# Altium schematic sheet Stereo_L&R_TPA3138D2.SchDoc
size A4; SheetNumber: 9; SheetTotal: 10
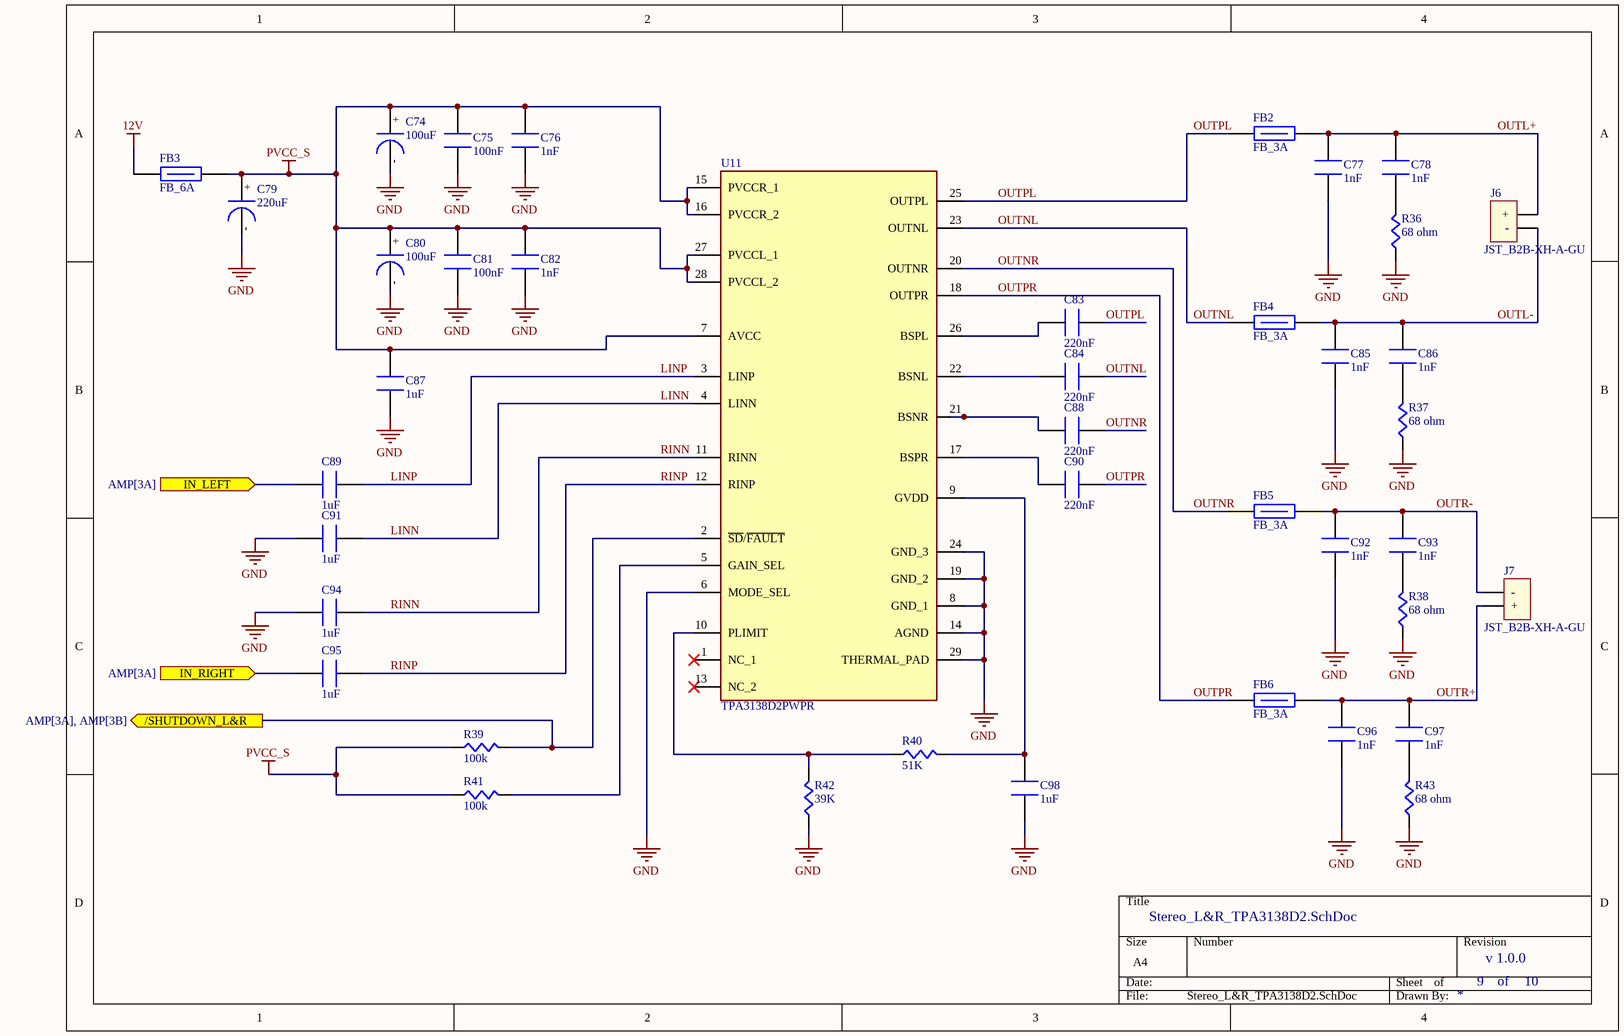
[diagram p0: Stereo_L&R_TPA3138D2.SchDoc]

## Parts
C74  100uF  [CAPD6.3XL6.3X77M]
C75  100nF  [CAPC0603X8N]
C76  1nF  [CAPC0603X8N]
C77  1nF  [CAPC0603X8N]
C78  1nF  [CAPC0603X8N]
C79  220uF  [CAPD6.3XL6.3X77M]
C80  100uF  [CAPD6.3XL6.3X77M]
C81  100nF  [CAPC0603X8N]
C82  1nF  [CAPC0603X8N]
C83  220nF  [CAPC1206X18N]
C84  220nF  [CAPC1206X18N]
C85  1nF  [CAPC0603X8N]
C86  1nF  [CAPC0603X8N]
C87  1uF  [CAP0805X13N]
C88  220nF  [CAPC1206X18N]
C89  1uF  [CAP0805X13N]
C90  220nF  [CAPC1206X18N]
C91  1uF  [CAP0805X13N]
C92  1nF  [CAPC0603X8N]
C93  1nF  [CAPC0603X8N]
C94  1uF  [CAP0805X13N]
C95  1uF  [CAP0805X13N]
C96  1nF  [CAPC0603X8N]
C97  1nF  [CAPC0603X8N]
C98  1uF  [CAP0805X13N]
FB2  FB_3A  [FB0603X08N]
FB3  FB_6A  [FB0805X12N]
FB4  FB_3A  [FB0603X08N]
FB5  FB_3A  [FB0603X08N]
FB6  FB_3A  [FB0603X08N]
J6  JST_B2B-XH-A-GU  [JST_B2B_XH_A_GU]
J7  JST_B2B-XH-A-GU  [JST_B2B_XH_A_GU]
R36  68 ohm  [RECS0603X45N]
R37  68 ohm  [RECS0603X45N]
R38  68 ohm  [RECS0603X45N]
R39  100k  [RECS0603X45N]
R40  51K  [RECS0603X45N]
R41  100k  [RECS0603X45N]
R42  39K  [RECS0603X45N]
R43  68 ohm  [RECS0603X45N]
U11  TPA3138D2PWPR  [SOP65P640X120-29N]

## Ports
/SHUTDOWN_L&R (out, see AMP[3A], AMP[3B]), IN_LEFT (in, see AMP[3A]), IN_RIGHT (in, see AMP[3A])

## Nets
12V: FB3.1
GND: C74.2 C75.1 C76.1 C77.1 C79.2 C80.2 C81.1 C82.1 C85.1 C87.1 C91.1 C92.1 C94.1 C96.1 C98.1 R36.1 R37.1 R38.1 R42.1 R43.1 U11.6(MODE_SEL) U11.8(GND_1) U11.14(AGND) U11.19(GND_2) U11.24(GND_3) U11.29(THERMAL_PAD)
PVCC_S: C74.1 C75.2 C76.2 C79.1 C80.1 C81.2 C82.2 C87.2 FB3.2 R39.1 R41.1 U11.7(AVCC) U11.15(PVCCR_1) U11.16(PVCCR_2) U11.27(PVCCL_1) U11.28(PVCCL_2)
/SHUTDOWN_L&R: R39.2 U11.2(~{SD}/~{FAULT}) ; port /SHUTDOWN_L&R
IN_LEFT: C89.1 ; port IN_LEFT
IN_RIGHT: C95.1 ; port IN_RIGHT
LINN: C91.2 U11.4(LINN)
LINP: C89.2 U11.3(LINP)
OUTL+: C77.2 C78.2 FB2.2 J6.1(+)
OUTL-: C85.2 C86.2 FB4.2 J6.2(-)
OUTNL: C84.2 FB4.1 U11.23(OUTNL)
OUTNR: C88.2 FB5.1 U11.20(OUTNR)
OUTPL: C83.2 FB2.1 U11.25(OUTPL)
OUTPR: C90.2 FB6.1 U11.18(OUTPR)
OUTR+: C96.2 C97.2 FB6.2 J7.1(+)
OUTR-: C92.2 C93.2 FB5.2 J7.2(-)
RINN: C94.2 U11.11(RINN)
RINP: C95.2 U11.12(RINP)
NetC78_1: C78.1 R36.2
NetC83_1: C83.1 U11.26(BSPL)
NetC84_1: C84.1 U11.22(BSNL)
NetC86_1: C86.1 R37.2
NetC88_1: C88.1 U11.21(BSNR)
NetC90_1: C90.1 U11.17(BSPR)
NetC93_1: C93.1 R38.2
NetC97_1: C97.1 R43.2
NetC98_2: C98.2 R40.2 U11.9(GVDD)
NetR40_1: R40.1 R42.2 U11.10(PLIMIT)
NetR41_2: R41.2 U11.5(GAIN_SEL)

Not connected (* = marked no-connect by the designer): U11 1(NC_1)* 13(NC_2)*

## Notes on the sheet
- v 1.0.0
- of
- (in symbol CPD6.3XL7.7_100uF_POLY) +; -
- (in symbol CPD6.3XL7.7_220uF_POLY) +; -

## Library data of the parts
C74 C80 = CPD6.3XL7.7_100uF_POLY: C5246554, HV1V107M0607PZ, -55℃~+105℃ 100uF 2.2mm 2000hrs 35V 6.3mm 7.7mm ±20% SMD,D6.3xL7.7mm Polymer Aluminum Capacitors ROHS; Supplier 1: LCSC; Supplier Part Number 1: C5246554
C75 C81 = CC0603_100nF_X7R: C14663, CC0603KRX7R9BB104, 100nF 50V X7R ±10% 0603 Multilayer Ceramic Capacitors MLCC - SMD/SMT ROHS; Supplier 1: element14 APAC; Supplier Part Number 1: CC0603KRX7R9BB104
C76 C82 = CC0603_1nF_X7R: C100040, CC0603KRX7R9BB102, 1nF 50V X7R ±10% 0603 Multilayer Ceramic Capacitors MLCC - SMD/SMT ROHS; Supplier 1: element14 APAC; Supplier Part Number 1: CC0603KRX7R9BB102
C77 C78 C85 C86 C92 C93 C96 C97 = CC0603_1nF_NPO: C106246, CC0603JRNPO9BN102, 1nF 50V NP0 ±5% 0603 Multilayer Ceramic Capacitors MLCC - SMD/SMT ROHS; Supplier 1: element14 APAC; Supplier Part Number 1: CC0603JRNPO9BN102
C79 = CPD6.3XL7.7_220uF_POLY: C5246541, HV1E227M0607PZ, -55℃~+105℃ 2.2mm 2000hrs 220uF 25V 6.3mm 7.7mm ±20% SMD,D6.3xL7.7mm Polymer Aluminum Capacitors ROHS; Supplier 1: LCSC; Supplier Part Number 1: C5246541
C83 C84 C88 C90 = CC1206_220nF_NPO: C464977, GRM31C5C1H224JE02L, 220nF 50V C0G ±5% 1206 Multilayer Ceramic Capacitors MLCC - SMD/SMT ROHS; Supplier 1: Chip One Stop; Supplier Part Number 1: GRM31C5C1H224JE02L
C87 C89 C91 C94 C95 C98 = CC0805_1uF_X7R: C28323, CL21B105KBFNNNE, 1uF 50V X7R ±10% 0805 Multilayer Ceramic Capacitors MLCC - SMD/SMT ROHS; Supplier 1: Future Electronics; Supplier Part Number 1: CL21B105KBFNNNE
FB2 FB4-FB6 = FB0603_3A: C107332, MPZ1608S101ATAH0, -55℃~+125℃ 1 100Ω@100MHz 30mΩ 3A ±25% 0603 Ferrite Beads ROHS; Supplier 1: element14 APAC; Supplier Part Number 1: MPZ1608S101ATAH0
FB3 = FB0805_6A: C136227, MPZ2012S300AT000, -55℃~+125℃ 1 10mΩ 30Ω@100MHz 6A ±25% 0805 Ferrite Beads ROHS; Supplier 1: element14 APAC; Supplier Part Number 1: MPZ2012S300AT000
J6 J7 = JST_B2B-XH-A-GU: C265283, B2B-XH-A-GU, -25℃~+85℃ 1 1x2P 2 2.5mm 250V 2P 3A 5.75mm 7.4mm 7mm Brass Gold K Pin PA66 Through Hole UL94V-0 White XH 插件,P=2.5mm Wire To Board Connector ROHS; Supplier 1: Verical; Supplier Part Number 1: B2B-XH-A-GU
R36-R38 R43 = RESC0603_68_THIN: C861523, RT0603BRD0768RL, -55℃~+155℃ 100mW 68Ω 75V Thin Film Resistor ±0.1% ±25ppm/℃ 0603 Chip Resistor - Surface Mount ROHS; Supplier 1: CoreStaff; Supplier Part Number 1: ST66570258
R39 R41 = RESC0603_100K_THIN: C116674, AC0603FR-07100KL, -55℃~+155℃ 100kΩ 100mW 75V Thick Film Resistor ±1% ±100ppm/℃ 0603 Chip Resistor - Surface Mount ROHS; Supplier 1: element14 APAC; Supplier Part Number 1: AC0603FR-07100KL
R40 = RESC0603_51K_THICK: C107231, RC0603FR-0751KL, -55℃~+155℃ 100mW 51kΩ 75V Thick Film Resistor ±1% ±100ppm/℃ 0603 Chip Resistor - Surface Mount ROHS; Supplier 1: element14 APAC; Supplier Part Number 1: RC0603FR-0751KL
R42 = RESC0603_39K_THICK: C163424, RC0603FR-0739KL, -55℃~+155℃ 100mW 39kΩ 75V Thick Film Resistor ±1% ±100ppm/℃ 0603 Chip Resistor - Surface Mount ROHS; Supplier 1: element14 APAC; Supplier Part Number 1: RC0603FR-0739KL
U11 = TPA3138D2PWPR: C475506, TPA3138D2PWPR, -10℃~+85℃ -70dB 0.04% 102dB 10W×2@6Ω、18.5W×1@4Ω 2-Channel 20mA 3.5V~14.4V Automatic mute/no-noise switch、Overvoltage protection、Digital programmable gain Class D TSSOP-28-EP Audio Amplifiers ROHS; Manufacturer_Name: Texas Instruments; Datasheet Link: http://www.ti.com/lit/gpn/tpa3138d2; Height: 1.2mm; Manufacturer_Part_Number: TPA3138D2PWPR; Mouser Part Number: 595-TPA3138D2PWPR; Mouser Price/Stock: https://www.mouser.co.uk/ProductDetail/Texas-Instruments/TPA3138D2PWPR?qs=fAHHVMwC%252BbipgX0F9%252BCw8A%3D%3D; Arrow Part Number: TPA3138D2PWPR; Arrow Price/Stock: null?region=nac; Supplier 1: DigiKey; Supplier Part Number 1: 296-51849-1-ND